# Altium schematic sheet Sheet1.SchDoc
size 840 x 594 mm; Scale: 1:1; Разраб.: Тимофеев; Обозначение документа: 0000-00-00-01 Э3; Пров.: Тимофеев; Утв.: Тимофеев; Номер листа: 1; Общее количество листов: 2; Наименование организации: TSL; Перв. применение: 5759-05-12-20 УП6359; Наименование изделия 1: WELDER; Наименование изделия 2: Схема электрическая; Наименование изделия 3: принципиальная; Нач. отд.: Нач. отд.; Фамилия нач. отд.: Тимофеев
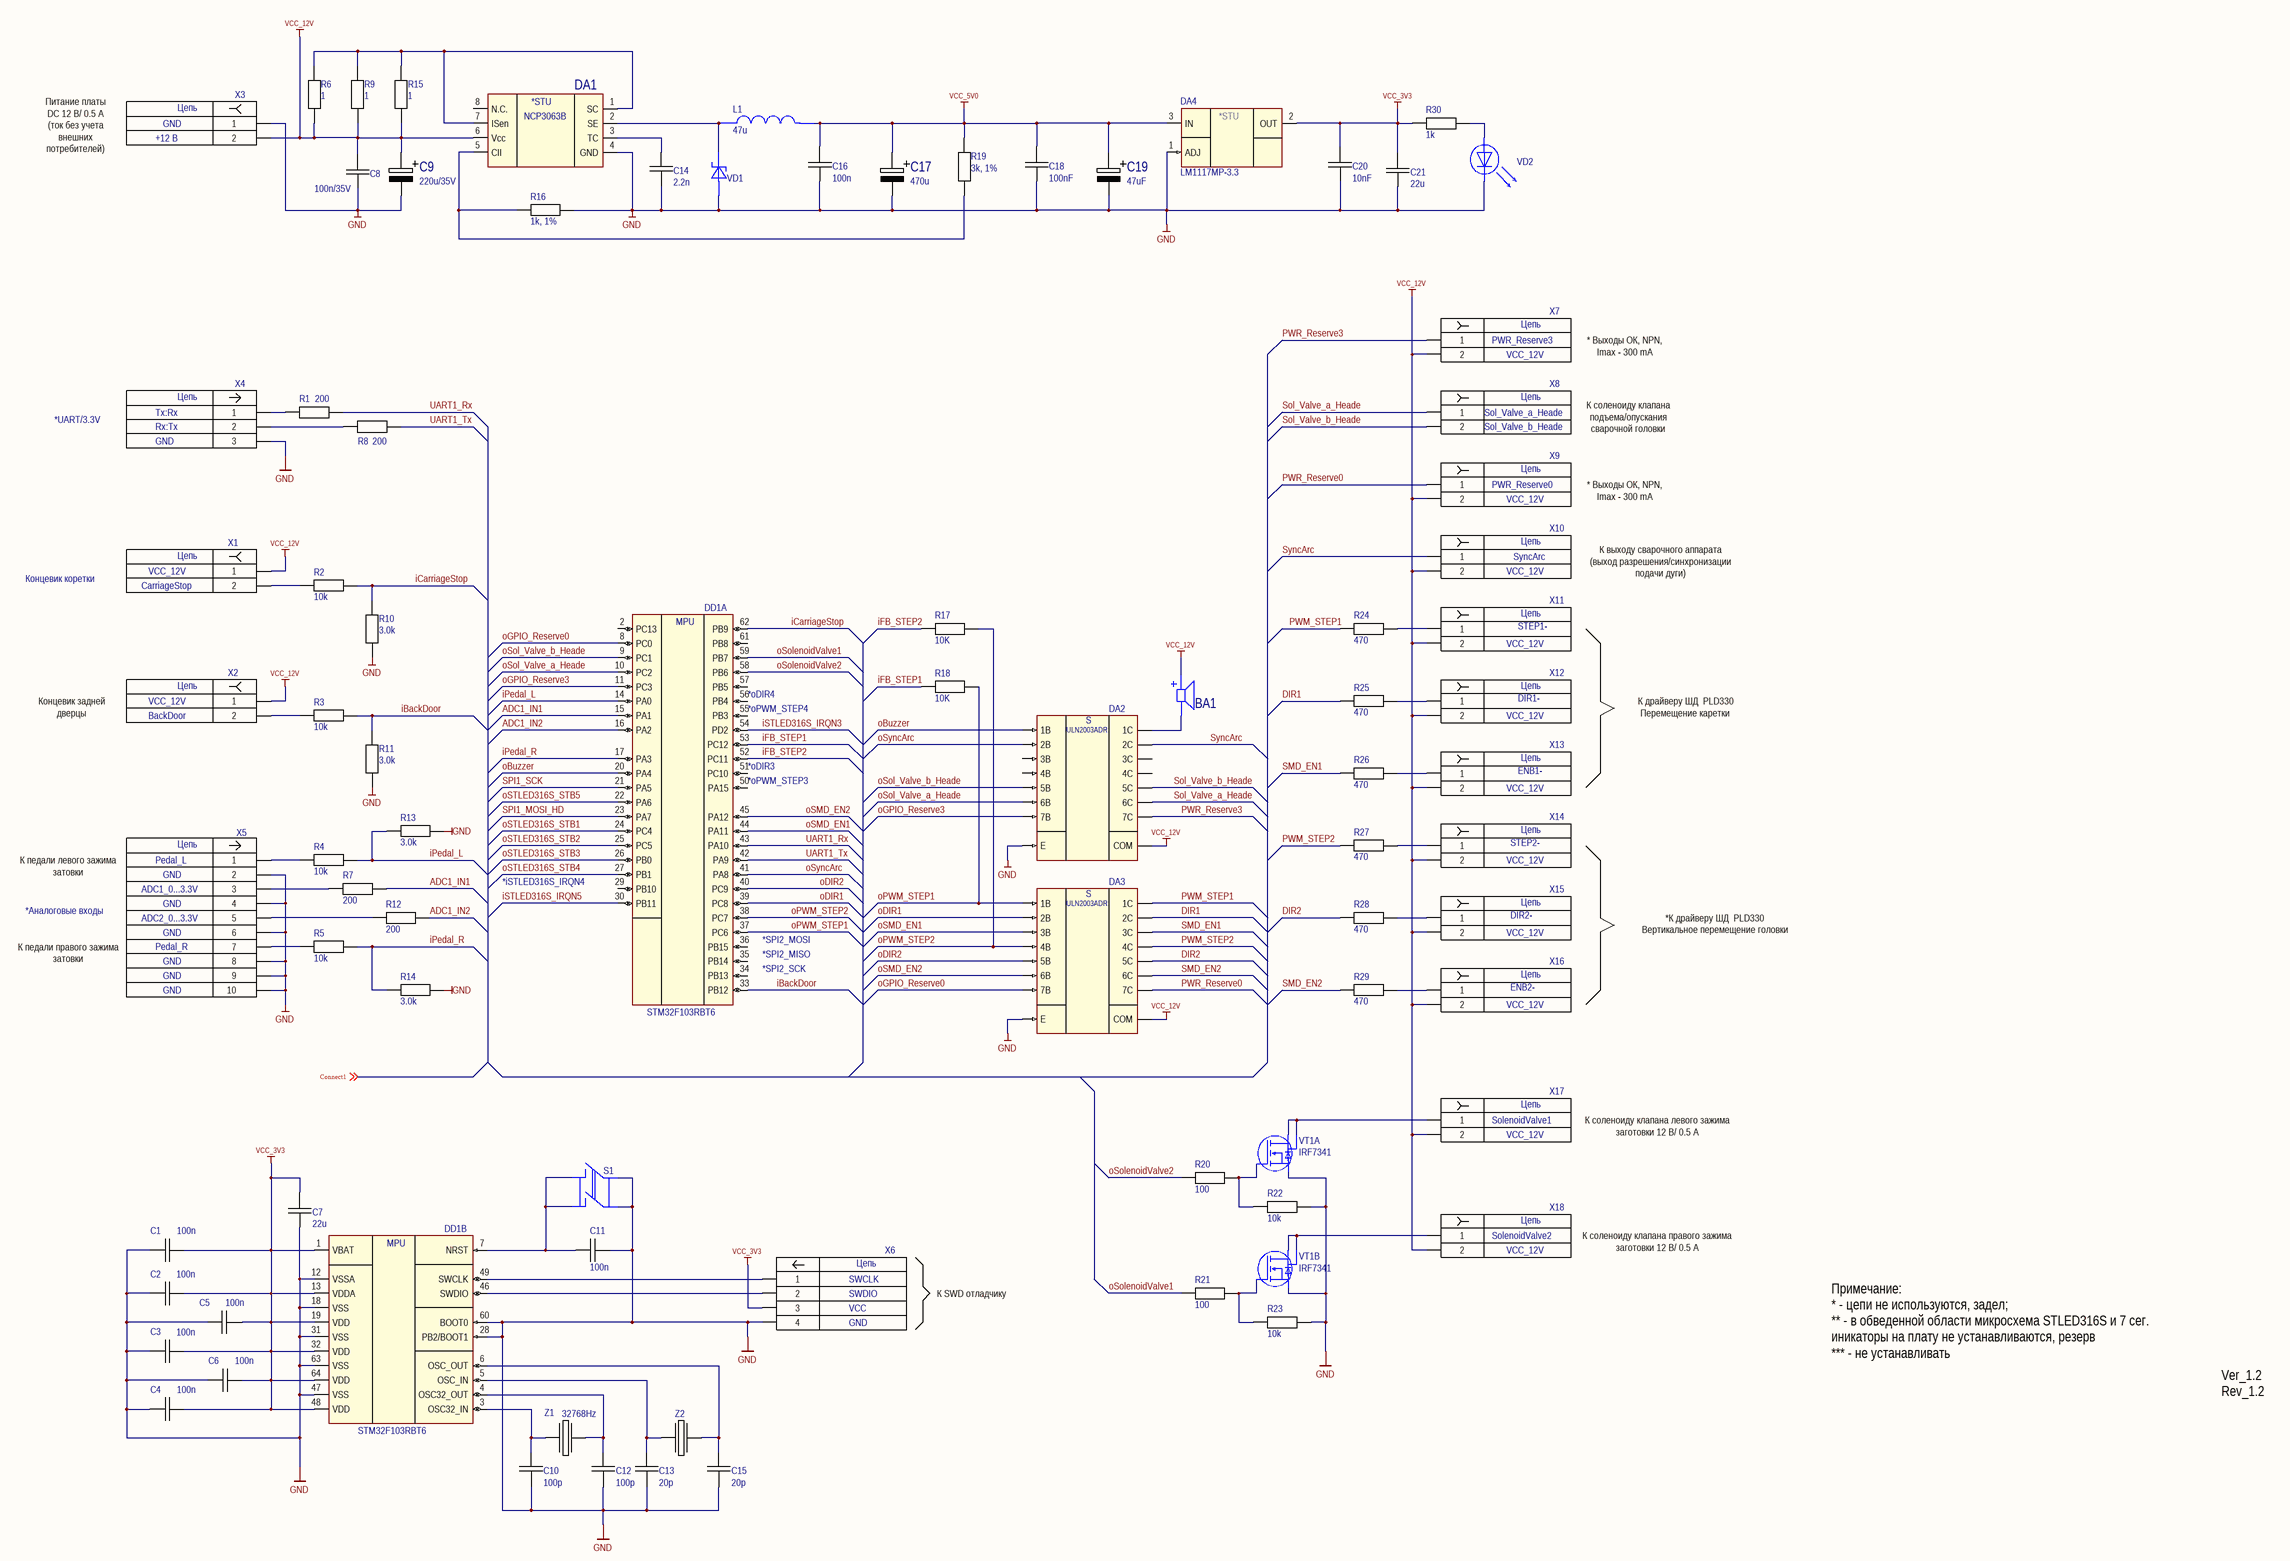
[diagram p0: Sheet1.SchDoc]

## Parts
BA1  Buzzer_HCM1212A  [Buzzer_HCM1212A]  (value not drawn)
C1  100n  [Capacitor_0805]
C2  100n  [Capacitor_0805]
C3  100n  [Capacitor_0805]
C4  100n  [Capacitor_0805]
C5  100n  [Capacitor_0805]
C6  100n  [Capacitor_0805]
C7  22u  [CAPACITOR_1206]
C8  100n/35V  [Capacitor_0805]
C9  220u/35V  [Capacitor_Electrolit_6.3x11]
C10  100p  [Capacitor_0805]  (no BOM)
C11  100n  [Capacitor_0805]
C12  100p  [Capacitor_0805]  (no BOM)
C13  20p  [Capacitor_0805]
C14  2.2n  [Capacitor_0805]
C15  20p  [Capacitor_0805]
C16  100n  [Capacitor_0805]
C17  470u  [Capacitor_Electrolit_6.3x11]
C18  100nF  [Capacitor_0805]
C19  47uF  [Capacitor_Electrolit_6.3x11]
C20  10nF  [Capacitor_0805]
C21  22u  [CAPACITOR_1206]
DA1  NCP3063B  [SOIC8]  (value not drawn)
DA2  ULN2003  [MCP3208_SOIC16]  (value not drawn)
DA3  ULN2003  [MCP3208_SOIC16]  (value not drawn)
DA4  LM1117MP-3.3  [NCP1117_SOT223]
DD1  STM32F103RBT6  [STM32F103RBT6_LQFP64]  (value not drawn)  (parts A,B of 2)
L1  47u  [INDUCTOR_CDRH8D28]
R1  200  [RESISTOR_SMD0805]
R2  10k  [RESISTOR_SMD0805]
R3  10k  [RESISTOR_SMD0805]
R4  10k  [RESISTOR_SMD0805]
R5  10k  [RESISTOR_SMD0805]
R6  1  [RESISTOR_SMD0805]
R7  200  [RESISTOR_SMD0805]
R8  200  [RESISTOR_SMD0805]
R9  1  [RESISTOR_SMD0805]
R10  3.0k  [RESISTOR_SMD0805]
R11  3.0k  [RESISTOR_SMD0805]
R12  200  [RESISTOR_SMD0805]
R13  3.0k  [RESISTOR_SMD0805]
R14  3.0k  [RESISTOR_SMD0805]
R15  1  [RESISTOR_SMD0805]
R16  1k, 1%  [RESISTOR_SMD0805]
R17  10K  [RESISTOR_SMD0805]
R18  10K  [RESISTOR_SMD0805]
R19  3k, 1%  [RESISTOR_SMD0805]
R20  100  [RESISTOR_SMD0805]
R21  100  [RESISTOR_SMD0805]
R22  10k  [RESISTOR_SMD0805]
R23  10k  [RESISTOR_SMD0805]
R24  470  [RESISTOR_SMD0805]
R25  470  [RESISTOR_SMD0805]
R26  470  [RESISTOR_SMD0805]
R27  470  [RESISTOR_SMD0805]
R28  470  [RESISTOR_SMD0805]
R29  470  [RESISTOR_SMD0805]
R30  1k  [RESISTOR_SMD0805]
S1  DTS-26 12x12x9.5  [Tact Switch_DTS-26_12x12x95]  (value not drawn)
VD1  STPS1L30A  [DIODE_STPS1L30A]  (value not drawn)
VD2  LED_FYL-3014GD1A  [LED_ FYL-3014GD1A]  (value not drawn)
VT1  IRF7341  [IRF7341_SO-8/SOIC-8]  (parts A,B of 2)
X1  Connector_DG306-5.0-02P  [CONNECTOR_DG306-5.0-02P]  (value not drawn)
X2  Connector_DG306-5.0-02P  [CONNECTOR_DG306-5.0-02P]  (value not drawn)
X3  Connector_DG306-5.0-02P  [CONNECTOR_DG306-5.0-02P]  (value not drawn)
X4  Connector_PLS-3  [CONNECTOR_PLS-3]  (value not drawn)
X5  Connector_PLD-10  [CONNECTOR_PLD-10]  (value not drawn)
X6  Connector_PLS-4  [CONNECTOR_PLS-4]  (value not drawn)
X7  Connector_DG306-5.0-02P  [CONNECTOR_DG306-5.0-02P]  (value not drawn)
X8  Connector_DG306-5.0-02P  [CONNECTOR_DG306-5.0-02P]  (value not drawn)
X9  Connector_DG306-5.0-02P  [CONNECTOR_DG306-5.0-02P]  (value not drawn)
X10  Connector_DG306-5.0-02P  [CONNECTOR_DG306-5.0-02P]  (value not drawn)
X11  Connector_DG306-5.0-02P  [CONNECTOR_DG306-5.0-02P]  (value not drawn)
X12  Connector_DG306-5.0-02P  [CONNECTOR_DG306-5.0-02P]  (value not drawn)
X13  Connector_DG306-5.0-02P  [CONNECTOR_DG306-5.0-02P]  (value not drawn)
X14  Connector_DG306-5.0-02P  [CONNECTOR_DG306-5.0-02P]  (value not drawn)
X15  Connector_DG306-5.0-02P  [CONNECTOR_DG306-5.0-02P]  (value not drawn)
X16  Connector_DG306-5.0-02P  [CONNECTOR_DG306-5.0-02P]  (value not drawn)
X17  Connector_DG306-5.0-02P  [CONNECTOR_DG306-5.0-02P]  (value not drawn)
X18  Connector_DG306-5.0-02P  [CONNECTOR_DG306-5.0-02P]  (value not drawn)
Z1  32768Hz  [Quartz_32768kHz]  (no BOM)
Z2  Quartz_KX-9A  [Quartz_KX-9]  (value not drawn)

## Nets
GND: C1.1 C2.1 C3.1 C4.1 C5.2 C6.1 C7.2 C8.2 C9.2 C10.1 C11.1 C12.1 C13.1 C14.1 C15.1 C16.2 C17.2 C18.2 C19.2 C20.2 C21.2 DA1.4(GND) DA2.8(E) DA3.8(E) DA4.1(ADJ) DD1.12(VSSA) DD1.18(VSS) DD1.28(PB2/BOOT1) DD1.31(VSS) DD1.47(VSS) DD1.60(BOOT0) DD1.63(VSS) R10.1 R11.1 R13.1 R14.1 R16.1 R22.1 R23.1 S1.3 S1.4 VD1.2 VD2.1 VT1.1 VT1.3 X3.1 X4.3 X5.2 X5.4 X5.6 X5.8 X5.9 X5.10 X6.4
VCC_3V3: C1.2 C2.2 C3.2 C4.2 C5.1 C6.2 C7.1 C20.1 C21.1 DA4.2(OUT) DD1.1(VBAT) DD1.13(VDDA) DD1.19(VDD) DD1.32(VDD) DD1.48(VDD) DD1.64(VDD) R30.2 X6.3
VCC_5V0: C16.1 C17.1 C18.1 C19.1 DA4.3(IN) L1.2 R19.1
VCC_12V: BA1.1 C8.1 C9.1 DA1.6(Vcc) DA2.9(COM) DA3.9(COM) R6.2 R9.2 R15.2 X1.1 X2.1 X3.2 X7.2 X9.2 X10.2 X11.2 X12.2 X13.2 X14.2 X15.2 X16.2 X17.2 X18.2
ADC1_IN1: DD1.15(PA1) R7.1
ADC1_IN2: DD1.16(PA2) R12.1
DIR1: DA3.15(2C) R25.2
DIR2: DA3.12(5C) R28.2
iBackDoor: DD1.33(PB12) R3.1 R11.2
iCarriageStop: DD1.62(PB9) R2.1 R10.2
iFB_STEP1: DD1.53(PC12) R18.1
iFB_STEP2: DD1.52(PC11) R17.1
iPedal_L: DD1.14(PA0) R4.1 R13.2
iPedal_R: DD1.17(PA3) R5.1 R14.2
iSTLED316S_IRQN3: DD1.54(PD2)
iSTLED316S_IRQN5: DD1.30(PB11)
oBuzzer: DA2.1(1B) DD1.20(PA4)
oDIR1: DA3.2(2B) DD1.39(PC8)
oDIR2: DA3.5(5B) DD1.40(PC9)
oGPIO_Reserve0: DA3.7(7B) DD1.8(PC0)
oGPIO_Reserve3: DA2.7(7B) DD1.11(PC3)
oPWM_STEP1: DA3.1(1B) DD1.37(PC6) R18.2
oPWM_STEP2: DA3.4(4B) DD1.38(PC7) R17.2
oSMD_EN1: DA3.3(3B) DD1.44(PA11)
oSMD_EN2: DA3.6(6B) DD1.45(PA12)
oSol_Valve_a_Heade: DA2.6(6B) DD1.10(PC2)
oSol_Valve_b_Heade: DA2.5(5B) DD1.9(PC1)
oSolenoidValve1: DD1.59(PB7) R21.2
oSolenoidValve2: DD1.58(PB6) R20.2
oSTLED316S_STB1: DD1.24(PC4)
oSTLED316S_STB2: DD1.25(PC5)
oSTLED316S_STB3: DD1.26(PB0)
oSTLED316S_STB4: DD1.27(PB1)
oSTLED316S_STB5: DD1.22(PA6)
oSyncArc: DA2.2(2B) DD1.41(PA8)
PWM_STEP1: DA3.16(1C) R24.2
PWM_STEP2: DA3.13(4C) R27.2
PWR_Reserve0: DA3.10(7C) X9.1
PWR_Reserve3: DA2.10(7C) X7.1
SMD_EN1: DA3.14(3C) R26.2
SMD_EN2: DA3.11(6C) R29.2
Sol_Valve_a_Heade: DA2.11(6C) X8.1
Sol_Valve_b_Heade: DA2.12(5C) X8.2
SPI1_MOSI_HD: DD1.23(PA7)
SPI1_SCK: DD1.21(PA5)
SyncArc: DA2.15(2C) X10.1
UART1_Rx: DD1.43(PA10) R1.1
UART1_Tx: DD1.42(PA9) R8.1
NetBA1_2: BA1.2 DA2.16(1C)
NetC10_2: C10.2 DD1.3(OSC32_IN) Z1.1
NetC11_2: C11.2 DD1.7(NRST) S1.1 S1.2
NetC12_2: C12.2 DD1.4(OSC32_OUT) Z1.2
NetC13_2: C13.2 DD1.5(OSC_IN) Z2.1
NetC14_2: C14.2 DA1.3(TC)
NetC15_2: C15.2 DD1.6(OSC_OUT) Z2.3
NetDA1_1: DA1.1(SC) DA1.7(ISen) R6.1 R9.1 R15.1
NetDA1_2: DA1.2(SE) L1.1 VD1.1
NetDA1_5: DA1.5(CII) R16.2 R19.2
NetDD1_46: DD1.46(SWDIO) X6.2
NetDD1_49: DD1.49(SWCLK) X6.1
NetR1_2: R1.2 X4.1
NetR2_2: R2.2 X1.2
NetR3_2: R3.2 X2.2
NetR4_2: R4.2 X5.1
NetR5_2: R5.2 X5.7
NetR7_2: R7.2 X5.3
NetR8_2: R8.2 X4.2
NetR12_2: R12.2 X5.5
NetR20_1: R20.1 R22.2 VT1.2
NetR21_1: R21.1 R23.2 VT1.4
NetR24_1: R24.1 X11.1
NetR25_1: R25.1 X12.1
NetR26_1: R26.1 X13.1
NetR27_1: R27.1 X14.1
NetR28_1: R28.1 X15.1
NetR29_1: R29.1 X16.1
NetR30_1: R30.1 VD2.2
NetVT1_5: VT1.5 VT1.6 X18.1
NetVT1_7: VT1.7 VT1.8 X17.1

Not connected (* = marked no-connect by the designer): DA1 8(N.C.); DA2 3(3B) 4(4B) 13(4C) 14(3C); DD1 2(PC13) 29(PB10) 34(PB13) 35(PB14) 36(PB15) 50(PA15) 51(PC10) 55(PB3) 56(PB4) 57(PB5) 61(PB8)

## Notes on the sheet
- Питание платы
  DC 12 В/ 0.5 А
  (ток без учета внешних потребителей)
- +12 В
- GND
- PWR_Reserve3
- VCC_12V
- * Выходы ОК, NPN,
  Imax - 300 mA
- *UART/3.3V
- Rx:Tx
- Tx:Rx
- Sol_Valve_a_Heade
- Sol_Valve_b_Heade
- К соленоиду клапана подъема/опускания сварочной головки
- PWR_Reserve0
- SyncArc
- Концевик коретки
- CarriageStop
- К выходу сварочного аппарата
  (выход разрешения/синхронизации подачи дуги)
- STEP1-
- (near DD1) *oDIR4
- DIR1-
- Концевик задней дверцы
- BackDoor
- (near DD1) *oPWM_STEP4
- К драйверу ШД  PLD330
  Перемещение каретки
- (near DD1) *oDIR3
- ENB1-
- (near DD1) *oPWM_STEP3
- STEP2-
- К педали левого зажима затовки
- Pedal_L
- *iSTLED316S_IRQN4
- *Аналоговые входы
- ADC1_0...3.3V
- ADC2_0...3.3V
- DIR2-
- К педали правого зажима затовки
- Pedal_R
- (near DD1) *SPI2_MOSI
- (near DD1) *SPI2_MISO
- *К драйверу ШД  PLD330
  Вертикальное перемещение головки
- (near DD1) *SPI2_SCK
- ENB2-
- SolenoidValve1
- К соленоиду клапана левого зажима заготовки 12 В/ 0.5 А
- SolenoidValve2
- К соленоиду клапана правого зажима заготовки 12 В/ 0.5 А
- SWCLK
- SWDIO
- VCC
- К SWD отладчику
- Примечание:
  * - цепи не используются, задел;
  ** - в обведенной области микросхема STLED316S и 7 сег. иникаторы на плату не устанавливаются, резерв
  *** - не устанавливать
- Ver_1.2
  Rev_1.2
- Перв. примен.
- Справ. №
- Подп. и дата
- Инв. № дубл.
- Взам. инв. №
- Разраб.
- Изм.
- Лист
- № докум.
- Подп.
- Дата
- Лит.
- Масса
- Масштаб
- Пров.
- Т.контр.
- Листов
- Инв. № подл.
- Утв.
- Н.контр.
- Копировал
- Формат А1
- (in symbol Connector_DG306-5.0-02P) Цепь
- (in symbol Connector_PLD-10) Цепь
- (in symbol Connector_PLS-3) Цепь
- (in symbol Connector_PLS-4) Цепь
- (in symbol LM1117MP-3.3) *STU
- (in symbol NCP3063B) *STU
- (in symbol STM32F103RBT6, part A) MPU
- (in symbol STM32F103RBT6, part B) MPU
- (in symbol ULN2003) S; ULN2003ADR

## Library data of the parts
C1-C6 C8 C10-C16 C18 C20 = Capacitor_0805
C7 C21 = Capacitor_1206
C9 C17 C19 = Capacitor+_6.3x11
L1 = Indluctor_CDRH8D28
R1-R30 = Resistor_0805
S1 = Tact_Switch_DTS-26_12x12x95
VD1 = Diode_STPS1L30A
Z1 = Quartz_32678Hz